# Altium schematic sheet mpc57_cwconn.SchDoc: CW308 UFO Connectors
size Letter; Organization: NewAE Technology Inc.; Address1: 1083 Queen St., Suite 196; Address2: Halifax; Address3: NS; Address4: Canada B3H 0B2; SheetApproved: YES
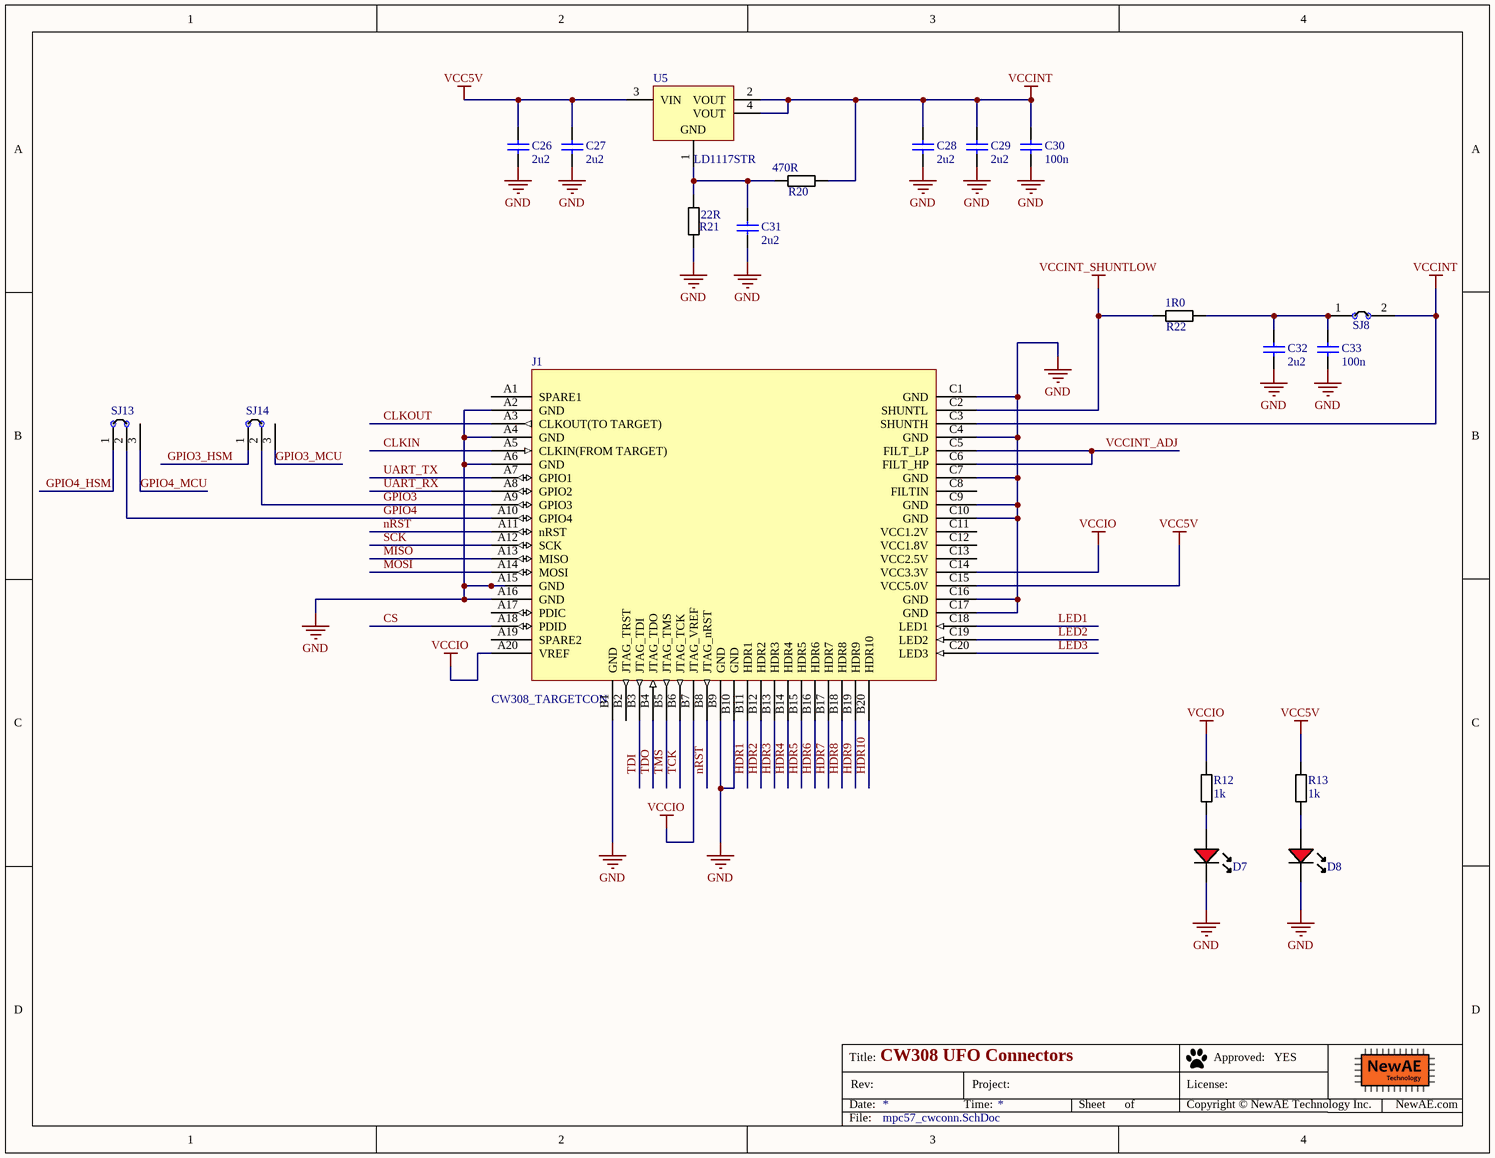
[diagram p0: mpc57_cwconn.SchDoc]

## Parts
C26  2u2  [CAPC0603_M]
C27  2u2  [CAPC0603_M]
C28  2u2  [CAPC0603_M]
C29  2u2  [CAPC0603_M]
C30  100n  [CAPC0402_M]
C31  2u2  [CAPC0603_M]
C32  2u2  [CAPC0603_M]
C33  100n  [CAPC0402_M]
D7  LED, 0603, Red  [LED-0603-RED]  (value not drawn)
D8  LED, 0603, Red  [LED-0603-RED]  (value not drawn)
J1  CW308_TARGETCON  [CW308_TBOARD_CONN]
R12  1k  [RESC1608X55N]
R13  1k  [RESC1608X55N]
R20  470R  [RESC1608X55N]
R21  22R  [RESC1608X55N]
R22  1R0  [RESC2012X70N]
SJ8  NC  [SJ_2S_NC]  (value not drawn)  (no BOM)
SJ13  NC  [SJ_3S_NC12]  (value not drawn)  (no BOM)
SJ14  NC  [SJ_3S_NC12]  (value not drawn)  (no BOM)
U5  LD1117STR  [SOT-223_L]

## Nets
GND: C26.2 C27.2 C28.2 C29.2 C30.2 C31.2 C32.2 C33.2 D7.K D8.K J1.A2(GND) J1.A4(GND) J1.A6(GND) J1.A15(GND) J1.A16(GND) J1.B1(GND) J1.B9(GND) J1.B10(GND) J1.C1(GND) J1.C4(GND) J1.C7(GND) J1.C9(GND) J1.C10(GND) J1.C16(GND) J1.C17(GND) R21.2
VCC5V: C26.1 C27.1 J1.C15(VCC5.0V) R13.1 U5.3(VIN)
VCCINT: C28.1 C29.1 C30.1 J1.C3(SHUNTH) R20.1 SJ8.2 U5.2(VOUT) U5.4(VOUT)
VCCINT_SHUNTLOW: J1.C2(SHUNTL) R22.1
VCCIO: J1.A20(VREF) J1.B7(JTAG_VREF) J1.C14(VCC3.3V) R12.1
CLKIN: J1.A5(CLKIN(FROM_TARGET))
CLKOUT: J1.A3(CLKOUT(TO_TARGET))
CS: J1.A18(PDID)
GPIO3: J1.A9(GPIO3) SJ14.2
GPIO3_HSM: SJ14.1
GPIO3_MCU: SJ14.3
GPIO4: J1.A10(GPIO4) SJ13.2
GPIO4_HSM: SJ13.1
GPIO4_MCU: SJ13.3
HDR1: J1.B11(HDR1)
HDR2: J1.B12(HDR2)
HDR3: J1.B13(HDR3)
HDR4: J1.B14(HDR4)
HDR5: J1.B15(HDR5)
HDR6: J1.B16(HDR6)
HDR7: J1.B17(HDR7)
HDR8: J1.B18(HDR8)
HDR9: J1.B19(HDR9)
HDR10: J1.B20(HDR10)
LED1: J1.C18(LED1)
LED2: J1.C19(LED2)
LED3: J1.C20(LED3)
MISO: J1.A13(MISO)
MOSI: J1.A14(MOSI)
nRST: J1.A11(nRST) J1.B8(JTAG_nRST)
SCK: J1.A12(SCK)
TCK: J1.B6(JTAG_TCK)
TDI: J1.B3(JTAG_TDI)
TDO: J1.B4(JTAG_TDO)
TMS: J1.B5(JTAG_TMS)
UART_RX: J1.A8(GPIO2)
UART_TX: J1.A7(GPIO1)
VCCINT_ADJ: J1.C5(FILT_LP) J1.C6(FILT_HP)
NetC31_1: C31.1 R20.2 R21.1 U5.1(GND)
NetC32_1: C32.1 C33.1 R22.2 SJ8.1
NetD7_A: D7.A R12.2
NetD8_A: D8.A R13.2

Not connected (* = marked no-connect by the designer): J1 A1(SPARE1) A17(PDIC) A19(SPARE2) B2(JTAG_TRST) C8(FILTIN) C11(VCC1.2V) C12(VCC1.8V) C13(VCC2.5V)

## Notes on the sheet
- Title:
- Date:
- Rev:
- Time:
- Project:
- Sheet
- of
- License:
- Copyright © NewAE Technology Inc.
- Approved:
- NewAE.com
- File:

## Library data of the parts
C26-C29 C31 C32 = CCHIP-2u2-0603: 2u2, 0603; Case-EIA: 0603; Case-Metric: 1608; Part Number: CCHIP-2u2-0603; Component Kind: Standard; Component Type: Standard; Footprint: 0603; Pin Count: 2; Value: 2u2; Mounting Technology: SMT
C30 C33 = CCHIP-100n-0402: 100n, 0402; Case-EIA: 0402; Part Number: CCHIP-100n-0402; Component Kind: Standard; Component Type: Standard; Footprint: 0402; Pin Count: 2; Value: 100n; Mounting Technology: SMT
D7 D8 = LEDCHIP_0603_RED: Chip LED, Red; Part Number: LEDCHIP_0603_RED; Component Kind: Standard; Component Type: Standard; Pin Count: 2; Mounting Technology: SMT
J1 = CW308_TBOARD: CW308 "Standard" Target Board Connector
R12 R13 = RCHIP-1K-0603: 1k res, 0603, 1%, 1/10W; Manufacture 1: Yageo; Manufacture Part Number 1: RC0603FR-071KL; Case-EIA: 0603; Case-Metric: 1608; Rated Power: 0.1W; Rated Voltage: 75VDC; Part Number: RCHIP-1K-0603; Component Kind: Standard; Component Type: Standard; Footprint: 0603; Pin Count: 2; Supplier 1: Digi-Key; Supplier Part Number 1: 311-1.00KHRCT-ND; Value: 1k; Tolerance: 1%; Mounting Technology: SMT; Temperature Range: -55C to 155C
R20 = RCHIP-120R-0603: 470R res, 0603, 1%, 1/10W; Manufacture 1: Yageo; Manufacture Part Number 1: RC0603FR-07470RL; Case-EIA: 0603; Case-Metric: 1608; Rated Power: 0.1W; Rated Voltage: 75VDC; Part Number: RCHIP-120R-0603; Component Kind: Standard; Component Type: Standard; Footprint: 0603; Pin Count: 2; Supplier 1: Digi-Key; Supplier Part Number 1: 311-470HRCT-ND; Value: 470R; Tolerance: 1%; Mounting Technology: SMT; Temperature Range: -55C to 155C
R21 = RCHIP-120R-0603: 120R res, 0603, 1%, 1/10W; Manufacture 1: Yageo; Manufacture Part Number 1: RC0603FR-0722RL; Case-EIA: 0603; Case-Metric: 1608; Rated Power: 0.1W; Rated Voltage: 75VDC; Part Number: RCHIP-120R-0603; Component Kind: Standard; Component Type: Standard; Footprint: 0603; Pin Count: 2; Supplier 1: Digi-Key; Supplier Part Number 1: 311-22HRCT-ND; Value: 22R; Tolerance: 1%; Mounting Technology: SMT; Temperature Range: -55C to 155C
R22 = RCHIP-1R0-0805: 1R0 res, 0805, 1%, 1/8W; Manufacture 1: Yageo; Manufacture Part Number 1: RC0805FR-071RL; Case-EIA: 0805; Rated Power: 0.125W; Rated Voltage: 75VDC; Part Number: RCHIP-1R0-0805; Component Kind: Standard; Component Type: Standard; Footprint: 0805; Pin Count: 2; Supplier 1: Digi-Key; Supplier Part Number 1: 311-1.00CRCT-ND; Value: 1R0; Tolerance: 1%; Mounting Technology: SMT; Temperature Range: -55C to 155C
SJ8 = SJ_2S: Solder Jumper, NC; Part Number: SJ_2S; Component Type: Standard (No BOM); Pin Count: 2
SJ13 SJ14 = SJ_3S_12JMP: Solder Jumper, NC; Component Group: PCB Feature; Part Number: SJ_3S_12JMP; Pin Count: 3; Mounting Technology: COPPER; Component Type: Standard (No BOM)
U5 = CMP-0244-00313-1: Adjustable Low Drop Voltage Regulator, 1.25 to 15V, 4-Pin SOT-223, Tape and Reel; ComponentLink2Description: Datasheet; PackageVersion: 2010; PackageReference: SOT-223; ComponentLink2URL: http://www.st.com/internet/com/TECHNICAL_RESOURCES/TECHNICAL_LITERATURE/DATASHEET/CD00000544.pdf; DatasheetVersion: 1/11/2011; ComponentLink1URL: http://www.st.com; PackageDescription: 4-Pin SOT-223 Package, 6.5 x 3.5 mm Body, 2.3 mm Pitch, 7 mm Lead Span; ComponentLink1Description: Manufacturer URL; Supplier 1: Digi-Key; Supplier Part Number 1: 497-1244-1-ND